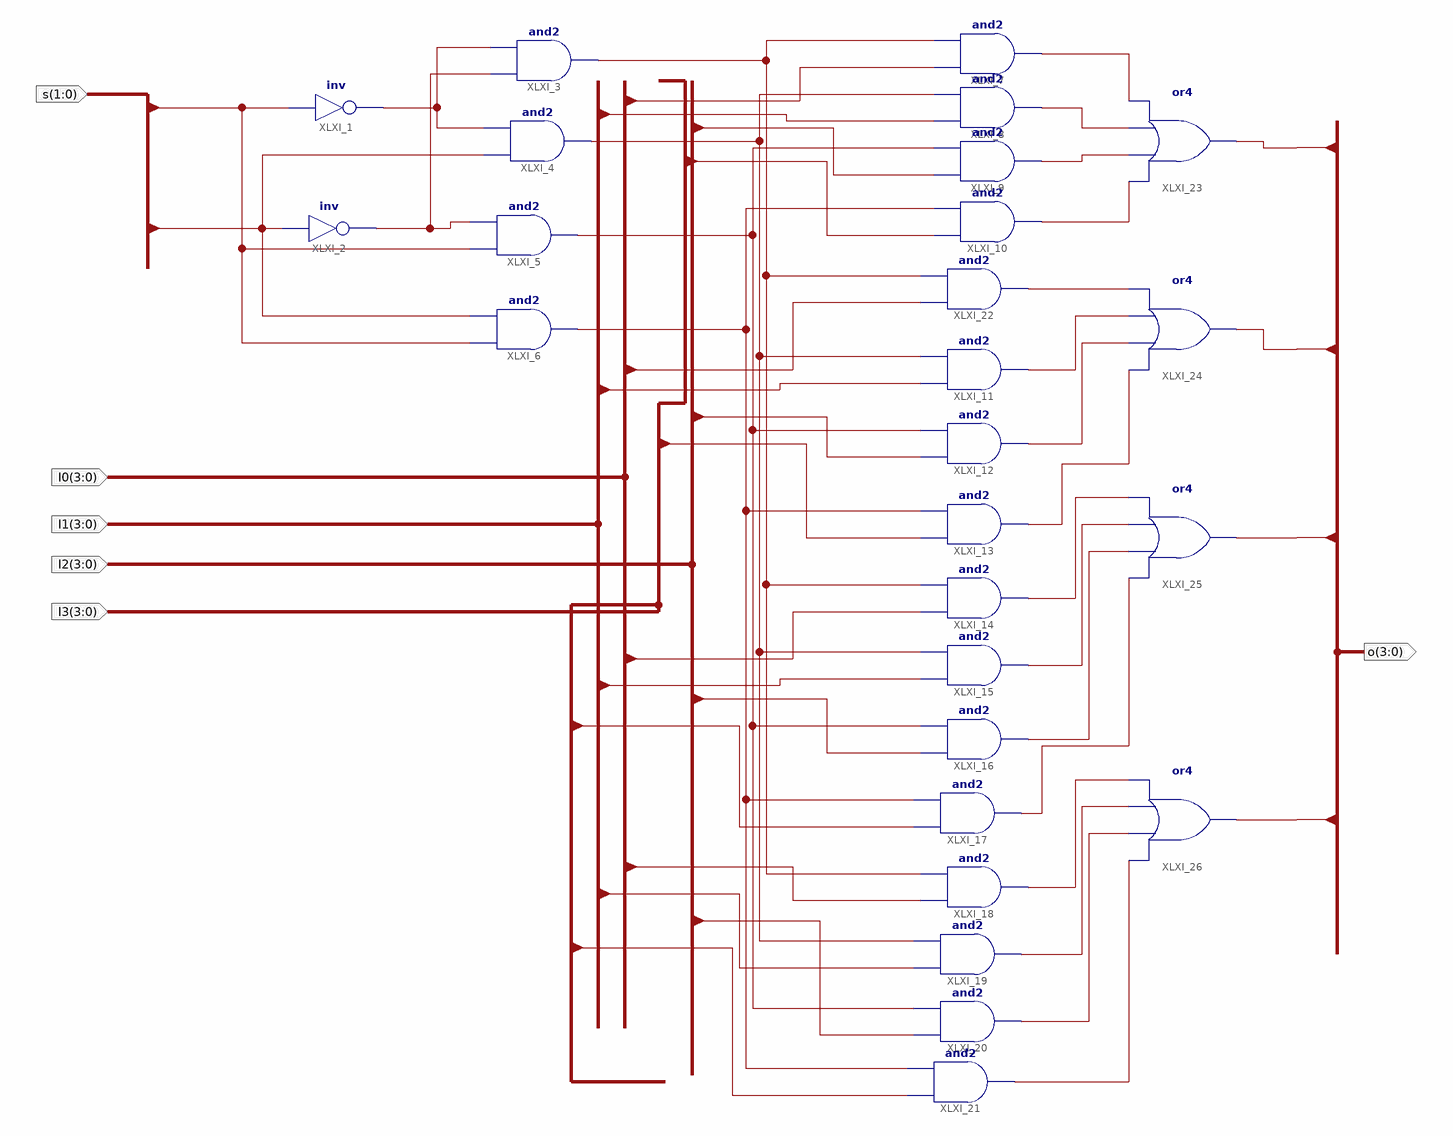
[diagram p0: schematic sheet 1]
// Xilinx ISE schematic Mux4to14b.sch (kintex7) as structural Verilog: 26 symbols, 6 ports
module Mux4to14b (
  input  [1:0] s,
  input  [3:0] I0,
  input  [3:0] I1,
  input  [3:0] I2,
  input  [3:0] I3,
  output [3:0] o
);

  wire XLXN_3, XLXN_5, XLXN_11, XLXN_15, XLXN_19, XLXN_23, XLXN_53, XLXN_54, XLXN_55, XLXN_56, XLXN_57,
       XLXN_58, XLXN_59, XLXN_60, XLXN_61, XLXN_62, XLXN_63, XLXN_64, XLXN_65, XLXN_66, XLXN_67, XLXN_68;

  not XLXI_1 (XLXN_3, s[1]);
  not XLXI_2 (XLXN_5, s[0]);
  and XLXI_3 (XLXN_11, XLXN_5, XLXN_3);
  and XLXI_4 (XLXN_15, s[0], XLXN_3);
  and XLXI_5 (XLXN_19, s[1], XLXN_5);
  and XLXI_6 (XLXN_23, s[1], s[0]);
  and XLXI_7 (XLXN_53, I0[0], XLXN_11);
  and XLXI_8 (XLXN_54, I1[0], XLXN_15);
  and XLXI_9 (XLXN_55, I2[0], XLXN_19);
  and XLXI_10 (XLXN_56, I3[0], XLXN_23);
  and XLXI_11 (XLXN_58, I1[1], XLXN_15);
  and XLXI_12 (XLXN_59, I2[1], XLXN_19);
  and XLXI_13 (XLXN_60, I3[1], XLXN_23);
  and XLXI_14 (XLXN_61, I0[2], XLXN_11);
  and XLXI_15 (XLXN_62, I1[2], XLXN_15);
  and XLXI_16 (XLXN_63, I2[2], XLXN_19);
  and XLXI_17 (XLXN_64, I3[2], XLXN_23);
  and XLXI_18 (XLXN_65, I0[3], XLXN_11);
  and XLXI_19 (XLXN_66, I1[3], XLXN_15);
  and XLXI_20 (XLXN_67, I2[3], XLXN_19);
  and XLXI_21 (XLXN_68, I3[3], XLXN_23);
  and XLXI_22 (XLXN_57, I0[1], XLXN_11);
  or XLXI_23 (o[0], XLXN_56, XLXN_55, XLXN_54, XLXN_53);
  or XLXI_24 (o[1], XLXN_60, XLXN_59, XLXN_58, XLXN_57);
  or XLXI_25 (o[2], XLXN_64, XLXN_63, XLXN_62, XLXN_61);
  or XLXI_26 (o[3], XLXN_68, XLXN_67, XLXN_66, XLXN_65);
endmodule
